# EAGLE design heater_board (EAGLE 6.6.0)
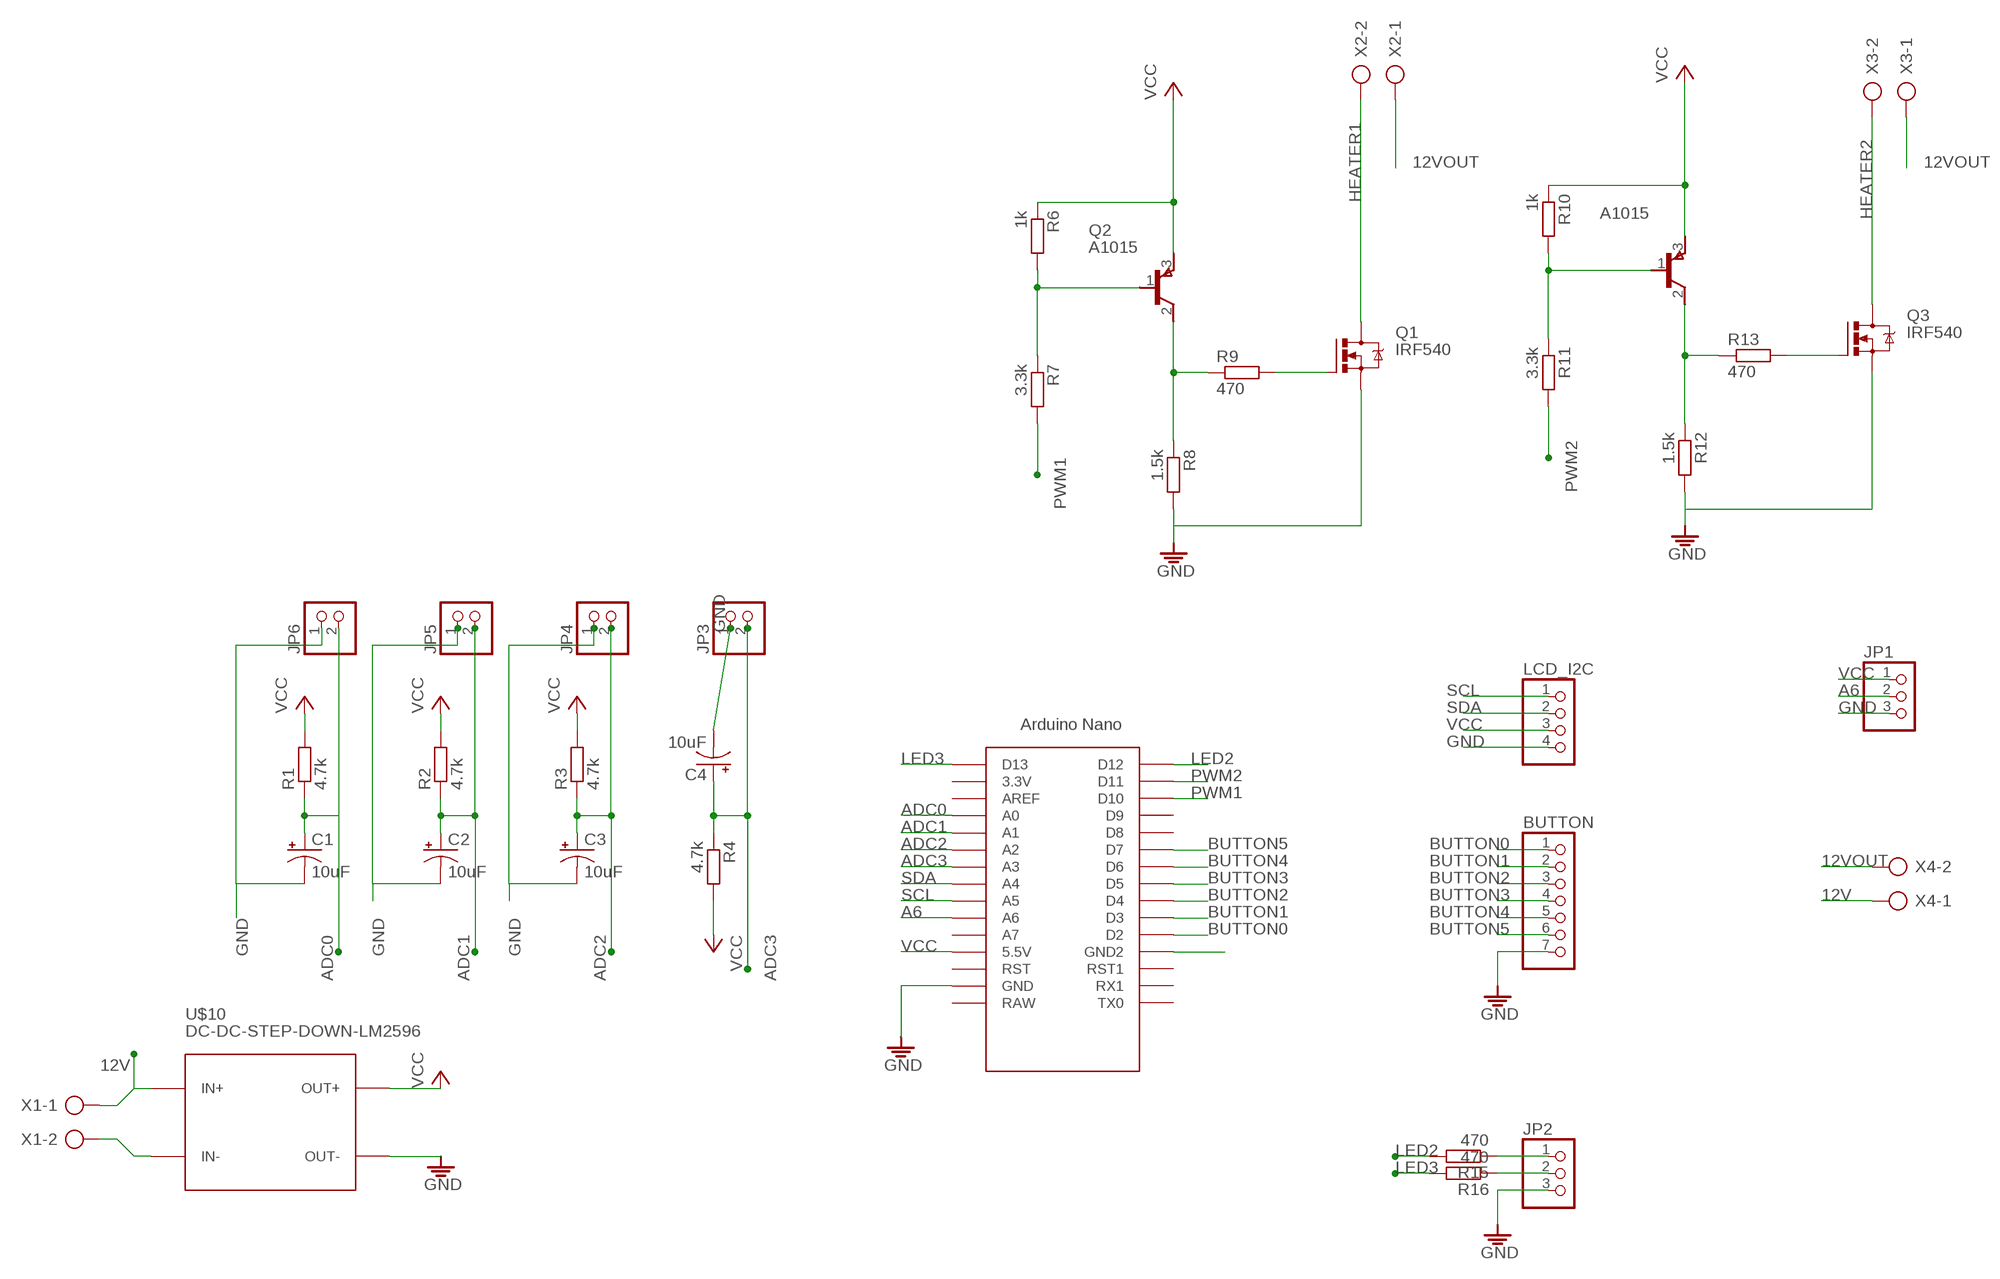
[diagram p0: schematic, sheet 1]

## Parts
A1015  A1015  [TO92L]
BUTTON  PINHD-1X7  [1X07]
C1  10uF  CPOL-USE2.5-5  [E2,5-5]
C2  10uF  CPOL-USE2.5-5  [E2,5-5]
C3  10uF  CPOL-USE2.5-5  [E2,5-5]
C4  10uF  CPOL-USE2.5-5  [E2,5-5]
JP1  PINHD-1X3  [1X03]
JP2  PINHD-1X3  [1X03]
JP3  PINHD-1X2  [1X02]
JP4  PINHD-1X2  [1X02]
JP5  PINHD-1X2  [1X02]
JP6  PINHD-1X2  [1X02]
LCD_I2C  PINHD-1X4  [1X04]
Q1  IRF540  [TO220BV]
Q2  A1015  [TO92L]
Q3  IRF540  [TO220BV]
R1  4.7k  R-EU_0207/10  [0207/10]
R2  4.7k  R-EU_0207/10  [0207/10]
R3  4.7k  R-EU_0207/10  [0207/10]
R4  4.7k  R-EU_0207/10  [0207/10]
R6  1k  R-EU_0207/10  [0207/10]
R7  3.3k  R-EU_0207/10  [0207/10]
R8  1.5k  R-EU_0207/10  [0207/10]
R9  470  R-EU_0207/10  [0207/10]
R10  1k  R-EU_0207/10  [0207/10]
R11  3.3k  R-EU_0207/10  [0207/10]
R12  1.5k  R-EU_0207/10  [0207/10]
R13  470  R-EU_0207/10  [0207/10]
R15  470  R-EU_0207/10  [0207/10]
R16  470  R-EU_0207/10  [0207/10]
U$1  NANO  [NANO]
U$10  DC-DC-STEP-DOWN-LM2596  [DC-DC-STEP-DOWN-LM2596]
X1  AK300/2  [AK300/2]
X2  AK300/2  [AK300/2]
X3  AK300/2  [AK300/2]
X4  AK300/2  [AK300/2]

## Nets
12V: U$10.IN+ X1.1 X4.1
12VOUT: X2.1 X3.1 X4.2
A6: JP1.2 U$1.A6
ADC0: C1.+ JP6.2 R1.1 U$1.A0
ADC1: C2.+ JP5.2 R2.1 U$1.A1
ADC2: C3.+ JP4.2 R3.1 U$1.A2
ADC3: C4.+ JP3.2 R4.1 U$1.A3
BUTTON0: BUTTON.1 U$1.D2
BUTTON1: BUTTON.2 U$1.D3
BUTTON2: BUTTON.3 U$1.D4
BUTTON3: BUTTON.4 U$1.D5
BUTTON4: BUTTON.5 U$1.D6
BUTTON5: BUTTON.6 U$1.D7
GND: BUTTON.7 C1.- C2.- C3.- C4.- JP1.3 JP2.3 JP3.1 JP4.1 JP5.1 JP6.1 LCD_I2C.4 Q1.S Q3.S R8.2 R12.2 U$1.GND U$1.GND1(GND2) U$10.IN- U$10.OUT- X1.2
HEATER1: Q1.D X2.2
HEATER2: Q3.D X3.2
LED2: R15.2 U$1.D12
LED3: R16.2 U$1.D13
N$1: Q1.G R9.2
N$2: JP2.1 R15.1
N$3: JP2.2 R16.1
N$5: Q2.2(C) R8.1 R9.1
N$6: Q3.G R13.2
N$7: Q2.1(B) R6.2 R7.1
N$8: A1015.2(C) R12.1 R13.1
N$9: A1015.1(B) R10.2 R11.1
PWM1: R7.2 U$1.D10
PWM2: R11.2 U$1.D11
SCL: LCD_I2C.1 U$1.A5
SDA: LCD_I2C.2 U$1.A4
VCC: A1015.3(E) JP1.1 LCD_I2C.3 Q2.3(E) R1.2 R2.2 R3.2 R4.2 R6.1 R10.1 U$1.5V(5.5V) U$10.OUT+
Unconnected: U$1.3.3V U$1.A7 U$1.AREF U$1.D8 U$1.D9 U$1.ICSP1 U$1.ICSP2 U$1.ICSP3 U$1.ICSP4 U$1.ICSP5 U$1.ICSP6 U$1.RAW U$1.RST U$1.RST1 U$1.RX1 U$1.TX0

## Library data of the parts
A1015 Q2 = chuong:A1015
BUTTON = pinhead:PINHD-1X7: PIN HEADER
C1-C4 = rcl:CPOL-US: POLARIZED CAPACITOR, American symbol
JP1 JP2 = pinhead:PINHD-1X3: PIN HEADER
JP3-JP6 = pinhead:PINHD-1X2: PIN HEADER
LCD_I2C = pinhead:PINHD-1X4: PIN HEADER
Q1 Q3 = transistor-power:IRF540: HEXFET Power MOSFET
R1-R4 R6-R13 R15 R16 = rcl:R-EU_: RESISTOR, European symbol
U$1 = Arduino-clone:NANO: Arduino Nano
U$10 = diy-modules:DC-DC-STEP-DOWN-LM2596: DC/DC Step-Down Regulator based on LM2596-ADJ chip LM2596 datasheet available here: http://www.ti.com/lit/ds/symlink/lm2596.pdf Click here to find device on ebay.com <http://www.ebay.com/sch/lm2596+power+regulator>
X1-X4 = con-ptr500:AK300/2: CONNECTOR; OC_FARNELL: unknown; OC_NEWARK: unknown

## Board
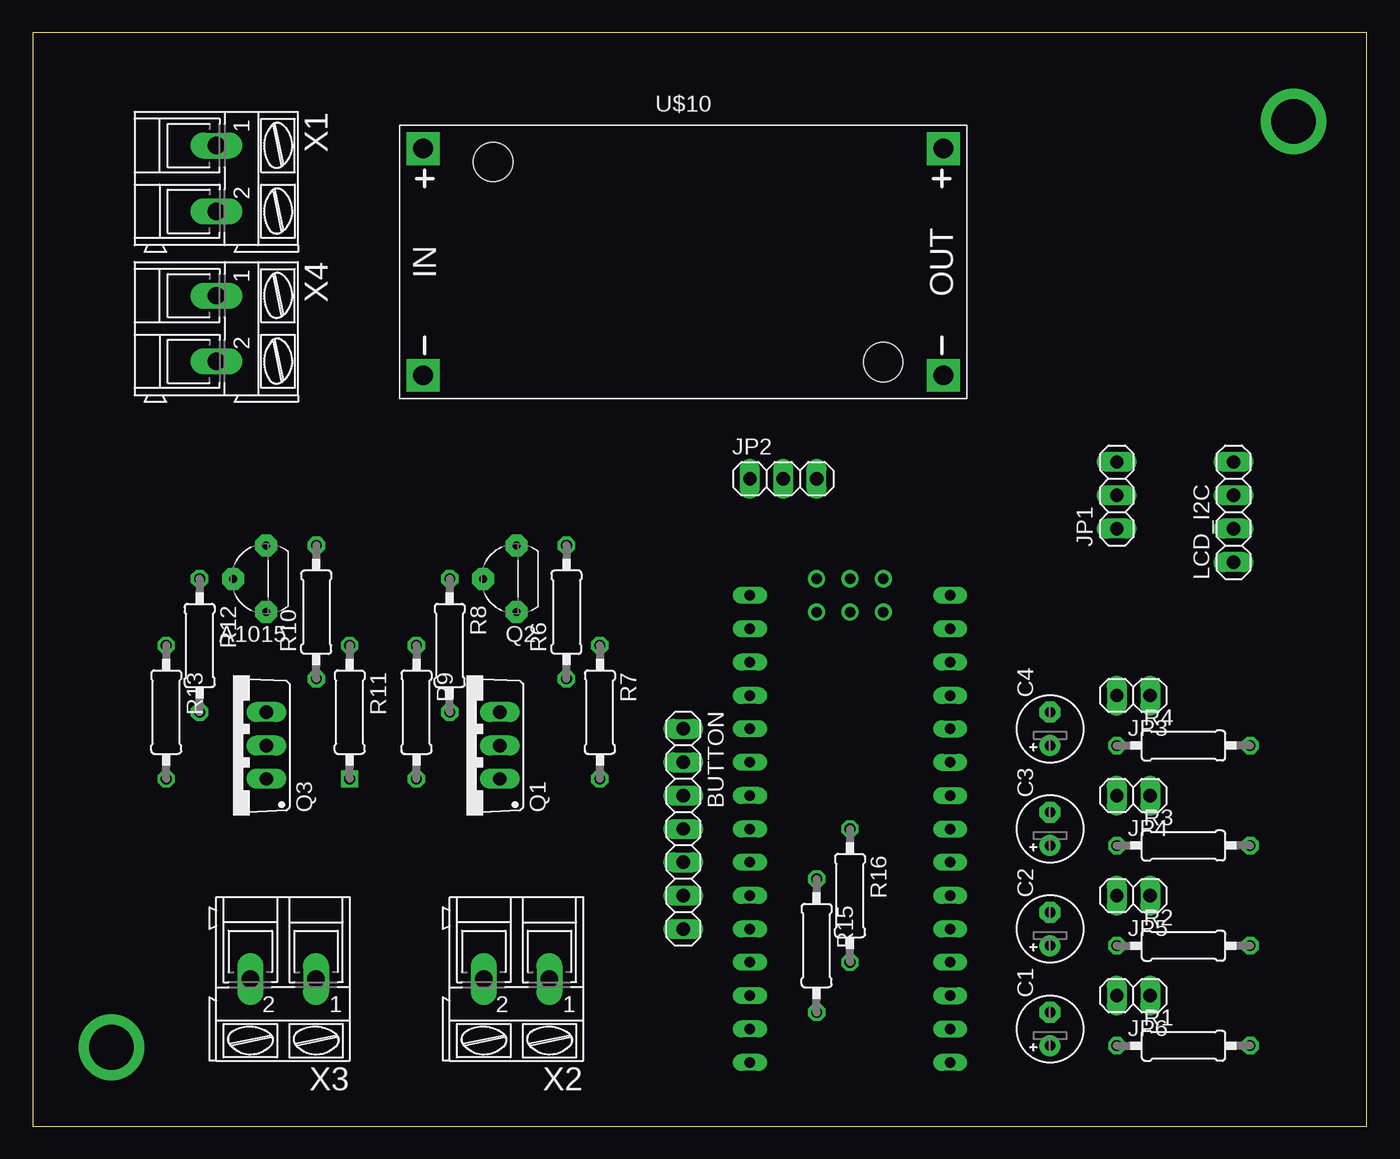
[diagram p1: board, top side]
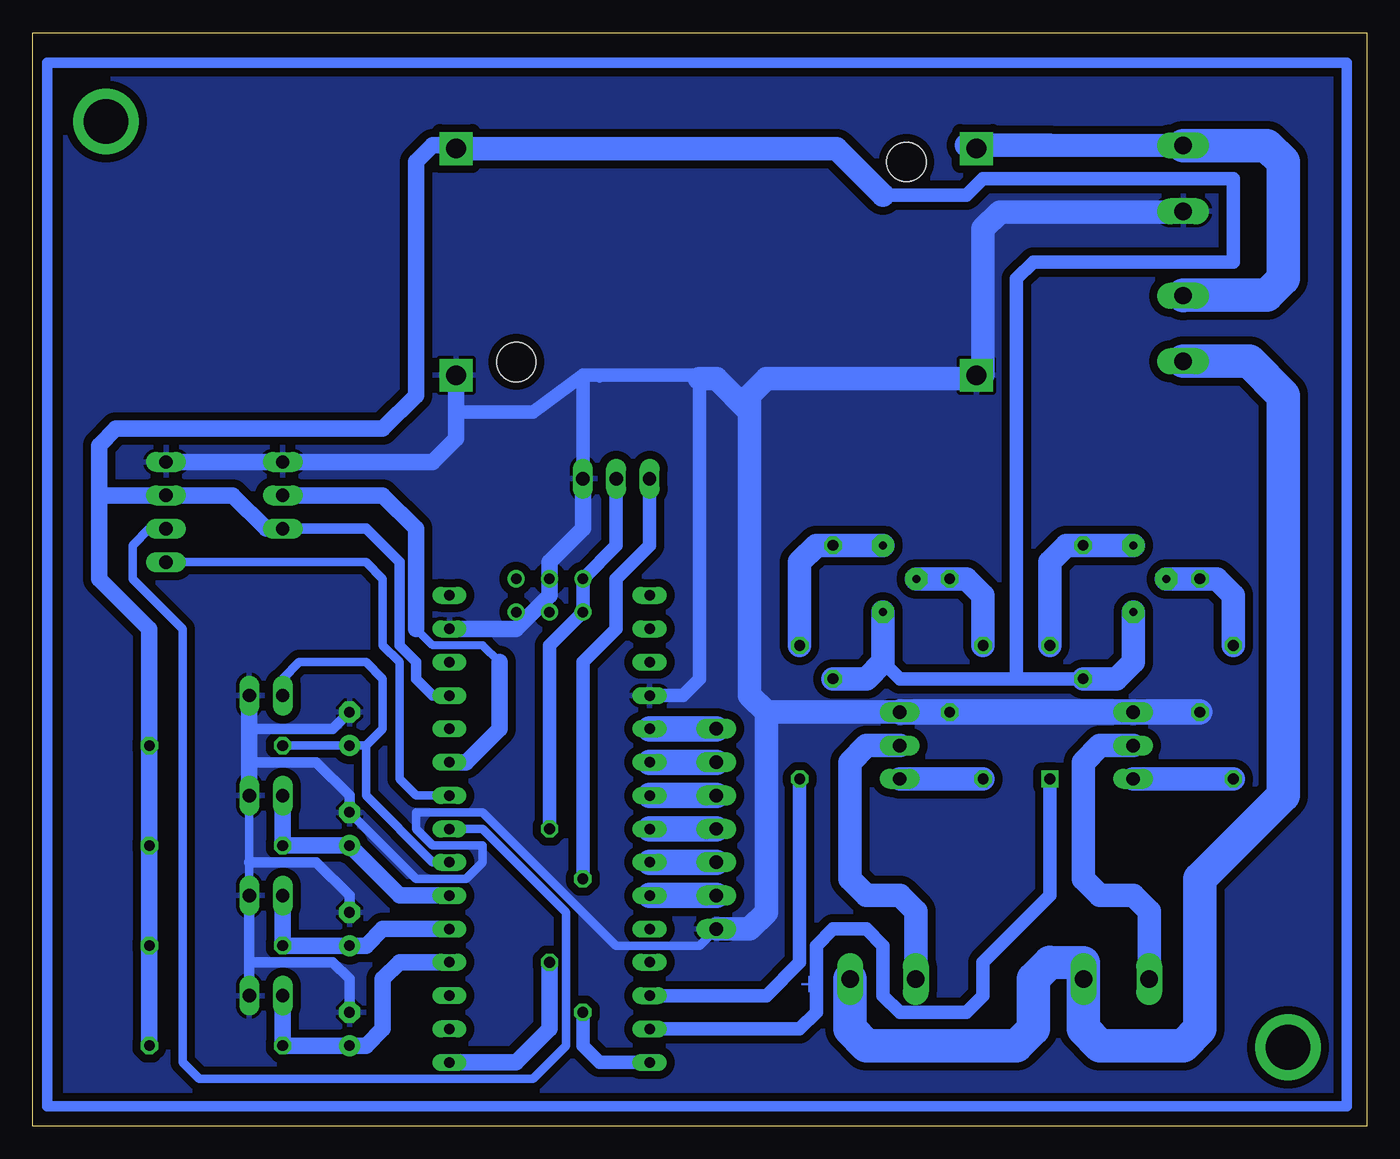
[diagram p2: board, bottom side, seen from below]

Size 101.58 x 83.26 mm. Coordinates in mm from the lower left corner, seen from the top.
Outline: 0,0 101.58,0 101.58,83.26 0,83.26 0,0
Copper layers (1*16): Top 0.035mm / dielectric 1.5mm / Bottom 0.035mm
Design rules "default *": minimum track width 25mil, minimum drill 24mil, track to track 10mil, track to pad 10mil, pad to pad 8mil, via to via 8mil, smd to smd 8mil, copper to edge 20mil, drill to drill 8mil, minimum pad ring 10mil, minimum via ring 8mil, stop-mask expansion 4mil, vias tented up to drill 0mil, thermal gap 10mil

### Footprints (pad centres in the part's own frame; a part is rotated, then mirrored left to right if it is on the bottom)
TO92L = drill 0.61 pad 1.676 octagon: 1 2.54,0; 2 0,2.54; 3 -2.54,0
1X07 = drill 1.016 long: 1 -7.62,0; 2 -5.08,0; 3 -2.54,0; 4 0,0; 5 2.54,0; 6 5.08,0; 7 7.62,0
E2,5-5 = drill 0.813 pad 1.6: + -1.27,0 | drill 0.813 pad 1.6 octagon: - 1.27,0
1X03 = drill 1.016 long: 1 -2.54,0; 2 0,0; 3 2.54,0
1X02 = drill 1.016 long: 1 -1.27,0; 2 1.27,0
1X04 = drill 1.016 long: 1 -3.81,0; 2 -1.27,0; 3 1.27,0; 4 3.81,0
TO220BV = drill 1.016 long: D 0,-2.54; G -2.54,-2.54; S 2.54,-2.54
0207/10 = drill 0.813 octagon: 1 -5.08,0; 2 5.08,0
NANO = drill 0.8 long: 3.3V -10.16,24.13; 5V -10.16,-1.27; A0 -10.16,19.05; A1 -10.16,16.51; A2 -10.16,13.97; A3 -10.16,11.43; A4 -10.16,8.89; A5 -10.16,6.35; A6 -10.16,3.81; A7 -10.16,1.27; AREF -10.16,21.59; D2 5.08,1.27; D3 5.08,3.81; D4 5.08,6.35; D5 5.08,8.89; D6 5.08,11.43; D7 5.08,13.97; D8 5.08,16.51; D9 5.08,19.05; D10 5.08,21.59; D11 5.08,24.13; D12 5.08,26.67; D13 -10.16,26.67; GND -10.16,-6.35; GND1 5.08,-1.27; RAW -10.16,-8.89; RST -10.16,-3.81; RST1 5.08,-3.81; RX1 5.08,-6.35; TX0 5.08,-8.89 | drill 0.8: ICSP1 -5.08,-10.16; ICSP2 -5.08,-7.62; ICSP3 -2.54,-10.16; ICSP4 -2.54,-7.62; ICSP5 0,-10.16; ICSP6 0,-7.62
DC-DC-STEP-DOWN-LM2596 = drill 1.5 pad 2.5 square: IN+ -19.812,8.636; IN- -19.812,-8.636; OUT+ 19.812,8.636; OUT- 19.812,-8.636 | hole 3: -14.478,7.62; 15.24,-7.62
AK300/2 = drill 1.321 long: 1 -2.515,0; 2 2.489,0

### Placement (x,y rotation side)
A1015  17.78,41.68 90 top
BUTTON  49.53,22.63 270 top
C1  77.47,7.39 90 top
C2  77.47,15.01 90 top
C3  77.47,22.63 90 top
C4  77.47,30.25 90 top
JP1  82.55,48.03 90 top
JP2  57.15,49.3 0 top
JP3  83.82,32.79 180 top
JP4  83.82,25.17 180 top
JP5  83.82,17.55 180 top
JP6  83.82,9.93 180 top
LCD_I2C  91.44,46.76 90 top
Q1  33.02,28.98 90 top
Q2  36.83,41.68 90 top
Q3  15.24,28.98 90 top
R1  87.63,6.12 0 top
R2  87.63,13.74 0 top
R3  87.63,21.36 0 top
R4  87.63,28.98 0 top
R6  40.64,39.14 90 top
R7  43.18,31.52 270 top
R8  31.75,36.6 270 top
R9  29.21,31.52 270 top
R10  21.59,39.14 90 top
R11  24.13,31.52 270 top
R12  12.7,36.6 270 top
R13  10.16,31.52 270 top
R15  59.69,13.74 270 top
R16  62.23,17.55 270 top
U$1  59.69,31.52 180 top
U$10  49.53,65.81 0 top
X1  13.97,72.16 270 top
X2  36.83,11.2 180 top
X3  19.05,11.2 180 top
X4  13.97,60.73 270 top

### Tracks (layer width: path | path; a pad name or v marks a point on that pad's centre or on a via)
12V
  Bottom 1.778: X1.1 24.13,74.7 30.48,74.7 U$10.IN+
  Bottom 2.54: X1.1 7.59,74.67 6.35,73.43 6.35,64.54 7.62,63.27 13.97,63.27 X4.1
12VOUT
  Bottom 2.54: X4.2 8.94,58.24 6.35,55.65 6.35,25.17 12.7,18.82 12.7,7.39 13.97,6.12 20.32,6.12 21.59,7.39 21.59,11.18 X3.1 21.57,12.45 24.13,12.47 25.4,11.2 25.4,7.39 26.67,6.12 38.1,6.12 39.37,7.39 39.37,11.18 X2.1
A6
  Bottom 0.61: 66.04,35.33 67.31,36.6 71.12,36.6 72.39,37.87
  Bottom 1.27: U$1.A6 68.58,27.71 66.04,30.25 66.04,35.33 | 72.39,37.87 72.39,45.49 74.93,48.03 JP1.2
ADC0
  Bottom 1.27: JP6.2 R1.1 C1.+ 76.2,6.12 74.93,7.39 74.93,11.2 73.66,12.47 U$1.A0
ADC1
  Bottom 1.27: U$1.A1 74.93,15.01 76.2,13.74 C2.+ R2.1 JP5.2
ADC2
  Bottom 1.27: U$1.A2 73.66,17.55 C3.+ R3.1 JP4.2
ADC3
  Bottom 0.635: U$1.A3 71.12,20.09 76.2,25.17 76.2,28.98 | 76.2,28.98 C4.+ R4.1 | JP3.2 82.55,34.06 81.28,35.33 76.2,35.33 74.93,34.06 74.93,30.25 76.2,28.98
BUTTON0
  Bottom 1.93: BUTTON.1 U$1.D2
BUTTON1
  Bottom 1.93: U$1.D3 BUTTON.2
BUTTON2
  Bottom 1.93: BUTTON.3 U$1.D4
BUTTON3
  Bottom 1.93: U$1.D5 BUTTON.4
BUTTON4
  Bottom 1.93: BUTTON.5 U$1.D6
BUTTON5
  Bottom 1.93: U$1.D7 BUTTON.6
GND
  Bottom 0.635: 68.58,56.92 U$10.OUT- | 58.42,56.92 58.42,57.17 | BUTTON.7 50.8,13.74 57.15,13.74 67.31,23.9 72.39,23.9 72.39,22.63 71.12,21.36 67.31,21.36 67.31,20.09 68.58,18.82 72.39,18.82 C3.- | JP5.1 85.09,20.09 JP4.1
  Bottom 0.813: C1.- 77.47,11.2 78.74,12.47 85.09,12.47 | 85.09,12.47 JP6.1 | JP5.1 85.09,12.47 | C2.- 77.47,17.55 80.01,20.09 85.09,20.09 | C4.- 78.74,30.25 85.09,30.25 | C3.- 77.47,25.17 80.01,27.71 85.09,27.71
  Bottom 1.016: 59.69,57.17 58.42,57.17 50.8,57.17 50.8,56.92 50.8,34.06 52.07,32.79 U$1.GND1 | 59.69,57.17 63.5,54.38 69.34,54.38 U$10.OUT- | JP2.3 59.69,57.17
  Bottom 1.27: U$1.GND 64.77,37.87 62.23,40.41 62.23,42.95 59.69,45.49 JP2.3 | U$10.OUT- 69.34,52.35 71.12,50.57 JP1.3 LCD_I2C.4 | JP3.1 85.09,30.25 85.09,27.71 JP4.1
  Bottom 1.778: X1.2 14.02,69.62 27.94,69.62 29.21,68.35 29.21,57.17 U$10.IN- 29.97,56.92 45.72,56.92 46.99,55.65 46.99,54.38 | Q1.S 45.72,31.52 | 45.72,31.52 46.99,32.79 46.99,54.38 | 45.72,31.52 45.72,16.28 46.99,15.01 BUTTON.7 | 46.99,54.38 49.53,56.92 50.8,56.92
  Bottom 1.93: R12.2 Q3.S | Q3.S 19.05,31.52 | Q3.S R8.2 Q1.S
  pour Bottom (isolate 0.61): 2.54,2.31 2.54,79.78 99.06,79.78 99.06,2.31
HEATER1
  Bottom 1.778: X2.2 34.34,16.33 35.56,17.55 38.1,17.55 39.37,18.82 39.37,27.71 38.1,28.98 Q1.D
HEATER2
  Bottom 1.778: X3.2 16.56,16.33 17.78,17.55 20.32,17.55 21.59,18.82 21.59,27.71 20.32,28.98 Q3.D
LED2
  Bottom 1.016: U$1.D12 58.42,4.85 59.69,6.12 R15.2
LED3
  Bottom 1.27: U$1.D13 64.77,4.85 62.23,7.39 R16.2
N$1
  Bottom 1.778: Q1.G R9.2
N$2
  Bottom 1.016: R15.1 59.69,35.33 57.15,37.87 57.15,41.68 54.61,44.22 JP2.1
N$3
  Bottom 1.016: JP2.2 57.15,44.22 59.69,41.68 59.69,39.14 62.23,36.6 R16.1
N$4
  Bottom 0.813: 1.5,81 1.5,1.5 100.5,1.5 100.5,81 1.5,81
N$5
  Bottom 1.778: R9.1 29.21,40.41 30.48,41.68 R8.1 Q2.2
N$6
  Bottom 1.778: Q3.G R13.2
N$7
  Bottom 1.778: R6.2 Q2.1 41.91,44.22 43.18,42.95 R7.1
N$8
  Bottom 1.778: R13.1 10.16,40.41 11.43,41.68 R12.1 A1015.2
N$9
  Bottom 1.778: R10.2 A1015.1 22.86,44.22 24.13,42.95 R11.1
N$10  (via drill 3.4 pad 5)
  other vias: 6,6
N$11  (via drill 3.4 pad 5)
  other vias: 96,76.5
PWM1
  Bottom 1.016: U$1.D10 45.72,9.93 43.18,12.47 R7.2
PWM2  (via drill 0.6 pad 1.27)
  Bottom 1.016: U$1.D11 43.18,7.39 41.91,8.66 41.91,13.74 40.64,15.01 38.1,15.01 36.83,13.74 36.83,9.93 35.56,8.66 30.48,8.66 29.21,9.93 29.21,12.47 24.13,17.55 R11.2
  other vias: 24.13,26.44
SCL
  Bottom 0.635: U$1.A5 72.39,25.17 73.66,26.44 73.66,35.33 74.93,36.6 74.93,41.68 76.2,42.95 LCD_I2C.1
SDA
  Bottom 0.635: U$1.A4 67.31,22.63 60.96,16.28 60.96,6.12 63.5,3.58 88.9,3.58 90.17,4.85 90.17,37.87 93.98,41.68 93.98,44.22 92.71,45.49 LCD_I2C.2
VCC
  Bottom 0.635: JP1.1 76.2,45.49
  Bottom 0.813: U$1.5V 71.12,32.79 72.39,34.06 72.39,35.33 73.66,36.6 73.66,42.95 76.2,45.49 83.82,45.49 | 86.36,48.03 96.52,48.03
  Bottom 1.016: 36.83,70.89 30.48,70.89 29.21,72.16 10.16,72.16 10.16,65.81 25.4,65.81 26.67,64.54 26.67,34.06 | 26.67,34.06 35.56,34.06 36.83,35.33 | 26.67,34.06 R10.1 | 69.6,74.7 U$10.OUT+
  Bottom 1.27: JP1.1 83.82,45.49 86.36,48.03 LCD_I2C.3 96.52,48.03 | 96.52,48.03 96.52,41.68 92.71,37.87 R4.2 R3.2 R2.2 R1.2 | 69.6,74.7 71.12,74.7 72.39,73.43 72.39,55.65 74.93,53.11 95.25,53.11 96.52,51.84 96.52,48.03
  Bottom 1.778: R10.1 19.05,34.06 17.78,35.33 A1015.3 | R6.1 38.1,34.06 36.83,35.33 Q2.3 | U$10.OUT+ 40.39,74.45 36.83,70.89

### Text on the board
Bottom: + | +